# EAGLE schematic dcdc3to5 (EAGLE 7.7.0)
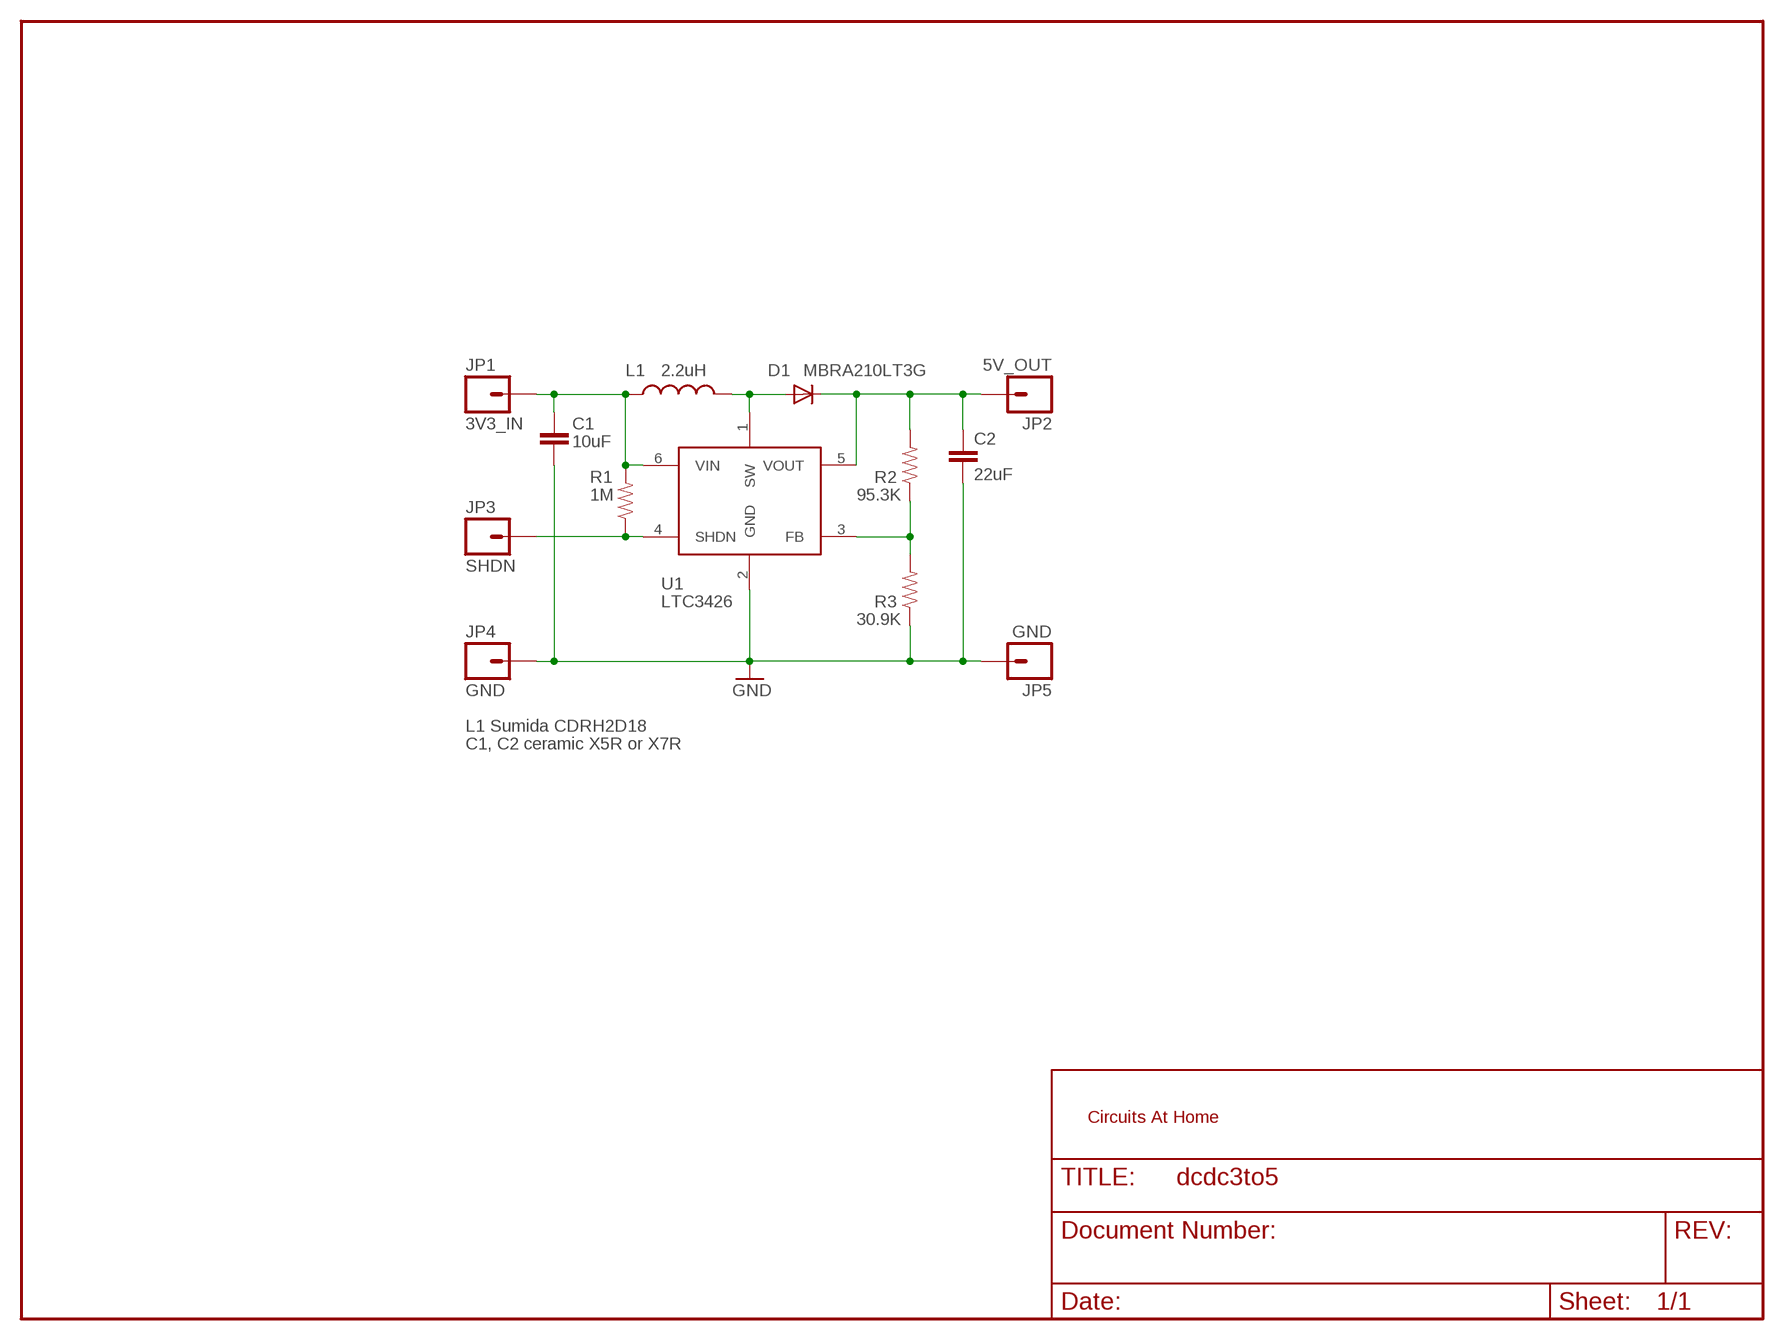
[diagram p0: schematic, sheet 1]

## Parts
C1  10uF  CAP0603  [0603]
C2  22uF  CAP1206  [1206]
D1  MBRA210LT3G  DIODESMA  [SMA-DIODE]
JP1  3V3_IN  M01PTH  [1X01]
JP2  5V_OUT  M01PTH  [1X01]
JP3  SHDN  M01PTH  [1X01]
JP4  GND  M01PTH  [1X01]
JP5  GND  M01PTH  [1X01]
L1  2.2uH  INDUCTOR1313  [1_3X1_3]
R1  1M  RESISTOR0603  [0603]
R2  95.3K  RESISTOR0603  [0603]
R3  30.9K  RESISTOR0603  [0603]
U1  LTC3426  [SOT23-6]

## Nets
3V3_IN: C1.1 JP1.1 L1.P$1 R1.2 U1.6(VIN)
GND: C1.2 C2.2 JP4.1 JP5.1 R3.1 U1.2(GND)
N$22: D1.A L1.P$2 U1.1(SW)
N$23: JP3.1 R1.1 U1.4(SHDN)
N$28: R2.1 R3.2 U1.3(FB)
N$31: C2.1 D1.C JP2.1 R2.2 U1.5(VOUT)

## Notes on the sheet
- L1 Sumida CDRH2D18
- C1, C2 ceramic X5R or X7R

## Library data of the parts
C1 C2 = CH_passive:CAP: Capacitor Standard 0603 ceramic capacitor, and 0.1" leaded capacitor.
D1 = CH_semiconductors:DIODE: Diode These are standard reverse protection diodes and small signal diodes. SMA package can handle up to about 1A. SOD-323 can handle about 200mA. What the SOD-323 package when ordering, there are some mfgs out there that are 5-pin packages.
JP1-JP5 = CH_connectors:M01: Header 1 Standard 1-pin 0.1" header. Use with straight break away headers (SKU : PRT-00116), right angle break away headers (PRT-00553), swiss pins (PRT-00743), machine pins (PRT-00117), and female headers (PRT-00115).
L1 = CH_passive:INDUCTOR: Inductors Basic Inductor/Choke - 0603 and 1206. Footprints are not proven and vary greatly between part numbers.
R1-R3 = CH_passive:RESISTOR: Resistor Basic schematic elements and footprints for 0603, 1206, and PTH 1/10th watt (small) resistors.
U1 = CH_Linear_technology:LTC3426